# EAGLE design Xmas_A_board (EAGLE 9.6.2)
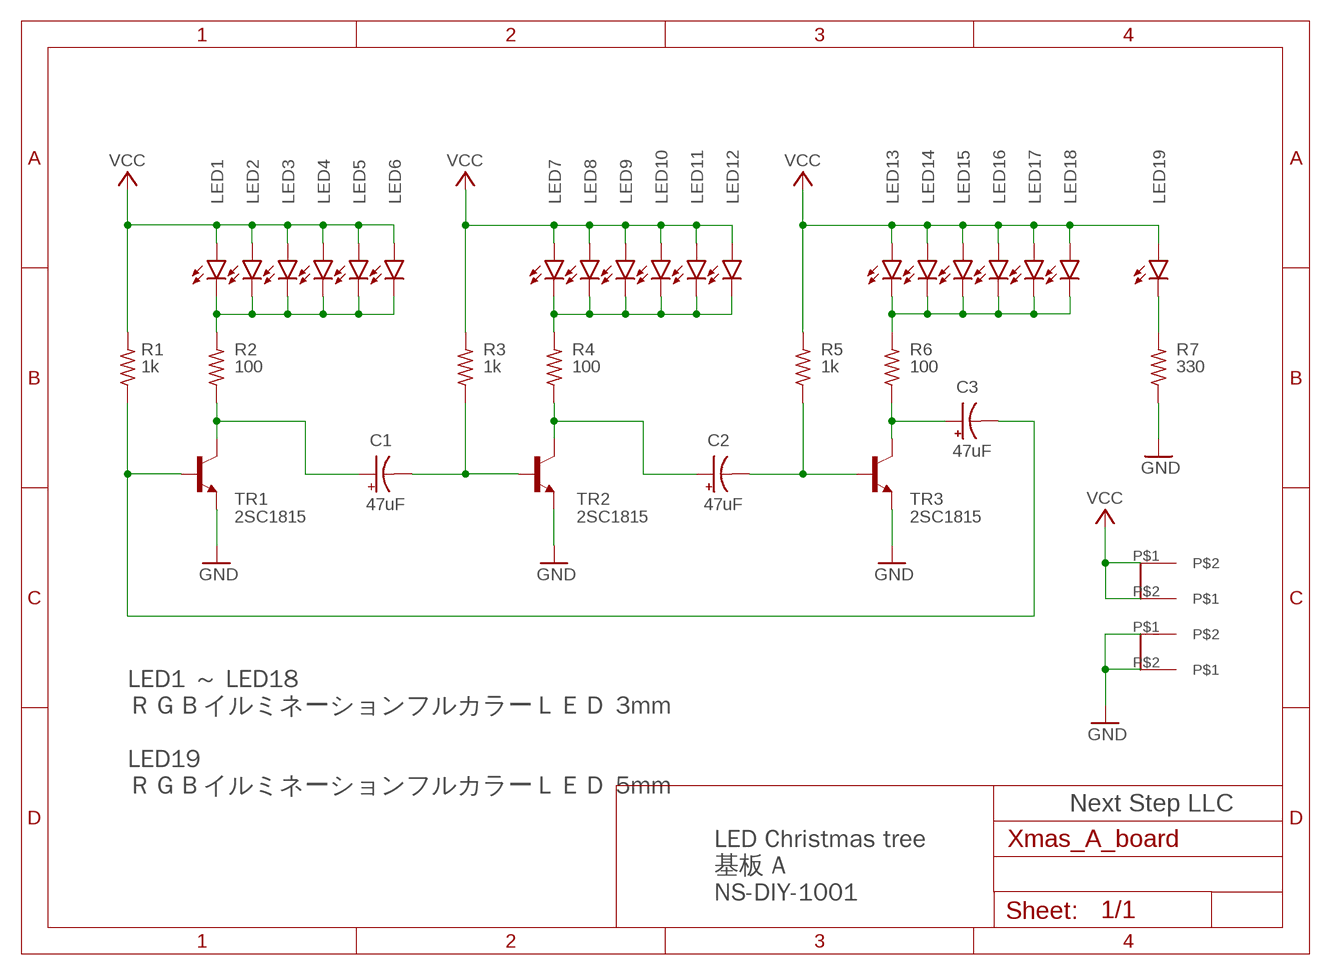
[diagram p0: schematic, sheet 1]

## Parts
C1  47uF  CPOL-USE2-4  [E2-4]
C2  47uF  CPOL-USE2-4  [E2-4]
C3  47uF  CPOL-USE2-4  [E2-4]
LED1  LED3MM  [LED3MM]
LED2  LED3MM  [LED3MM]
LED3  LED3MM  [LED3MM]
LED4  LED3MM  [LED3MM]
LED5  LED3MM  [LED3MM]
LED6  LED3MM  [LED3MM]
LED7  LED3MM  [LED3MM]
LED8  LED3MM  [LED3MM]
LED9  LED3MM  [LED3MM]
LED10  LED3MM  [LED3MM]
LED11  LED3MM  [LED3MM]
LED12  LED3MM  [LED3MM]
LED13  LED3MM  [LED3MM]
LED14  LED3MM  [LED3MM]
LED15  LED3MM  [LED3MM]
LED16  LED3MM  [LED3MM]
LED17  LED3MM  [LED3MM]
LED18  LED3MM  [LED3MM]
LED19  LED5MM  [LED5MM]
R1  1k  R-US_0204/7  [0204/7]
R2  100  R-US_0204/7  [0204/7]
R3  1k  R-US_0204/7  [0204/7]
R4  100  R-US_0204/7  [0204/7]
R5  1k  R-US_0204/7  [0204/7]
R6  100  R-US_0204/7  [0204/7]
R7  330  R-US_0204/7  [0204/7]
TR1  2SC1815  [TO92-ECB]
TR2  2SC1815  [TO92-ECB]
TR3  2SC1815  [TO92-ECB]
U$1  XMAS_POWER  [XMAS_POWER]
U$2  XMAS_POWER  [XMAS_POWER]

## Nets
GND: R7.1 TR1.E TR2.E TR3.E U$1.P$1 U$1.P$2
N$1: C3.- R1.1 TR1.B
N$2: LED1.K(C) LED2.K(C) LED3.K(C) LED4.K(C) LED5.K(C) LED6.K(C) R2.2
N$3: C1.+ R2.1 TR1.C
N$4: LED7.K(C) LED8.K(C) LED9.K(C) LED10.K(C) LED11.K(C) LED12.K(C) R4.2
N$5: C2.+ R4.1 TR2.C
N$6: C1.- R3.1 TR2.B
N$7: C3.+ R6.1 TR3.C
N$8: C2.- R5.1 TR3.B
N$10: LED13.K(C) LED14.K(C) LED15.K(C) LED16.K(C) LED17.K(C) LED18.K(C) R6.2
N$13: LED19.K(C) R7.2
VCC: LED1.A LED2.A LED3.A LED4.A LED5.A LED6.A LED7.A LED8.A LED9.A LED10.A LED11.A LED12.A LED13.A LED14.A LED15.A LED16.A LED17.A LED18.A LED19.A R1.2 R3.2 R5.2 U$2.P$1 U$2.P$2

## Notes on the sheet
- LED1 ～ LED18
  ＲＧＢイルミネーションフルカラーＬＥＤ 3mm
  
  LED19
  ＲＧＢイルミネーションフルカラーＬＥＤ 5mm
- Next Step LLC
- LED Christmas tree
  基板 A
  NS-DIY-1001

## Library data of the parts
C1-C3 = rcl:CPOL-US: POLARIZED CAPACITOR, American symbol; SPICEPREFIX: C
LED1-LED19 = led:LED: LED OSRAM: - CHIPLED LG R971, LG N971, LY N971, LG Q971, LY Q971, LO R971, LY R971 LH N974, LH R974 LS Q976, LO Q976, LY Q976 LO Q996 - Hyper CHIPLED LW Q18S LB Q993, LB Q99A, LB R99A - SideLED LS A670, LO A670, LY A670, LG A670, LP A670 LB A673, LV A673, LT A673, LW A673 LH A674 LY A675 LS A676, LA A676, LO A676, LY A676, LW A676 LS A679, LY A679, LG A679 - Hyper Micro SIDELED® LS Y876, LA Y876, LO Y876, LY Y876 LT Y87S - SmartLED LW L88C, LW L88S LB L89C, LB L89S, LG L890 LS L89K, LO L89K, LY L89K LS L896, LA L896, LO L896, LY L896 - TOPLED LS T670, LO T670, LY T670, LG T670, LP T670 LSG T670, LSP T670, LSY T670, LOP T670, LYG T670 LG T671, LOG T671, LSG T671 LB T673, LV T673, LT T673, LW T673 LH T674 LS T676, LA T676, LO T676, LY T676, LB T676, LH T676, LSB T676, LW T676 LB T67C, LV T67C, LT T67C, LS T67K, LO T67K, LY T67K, LW E67C LS E67B, LA E67B, LO E67B, LY E67B, LB E67C, LV E67C, LT E67C LW T67C LS T679, LY T679, LG T679 LS T770, LO T770, LY T770, LG T770, LP T770 LB T773, LV T773, LT T773, LW T773 LH T774 LS E675, LA E675, LY E675, LS T675 LS T776, LA T776, LO T776, LY T776, LB T776 LHGB T686 LT T68C, LB T68C - Hyper Mini TOPLED® LB M676 - Mini TOPLED Santana® LG M470 LS M47K, LO M47K, LY M47K Source: http://www.osram.convergy.de LUXEON: - LUMILED® LXK2-PW12-R00, LXK2-PW12-S00, LXK2-PW14-U00, LXK2-PW14-V00 LXK2-PM12-R00, LXK2-PM12-S00, LXK2-PM14-U00 LXK2-PE12-Q00, LXK2-PE12-R00, LXK2-PE12-S00, LXK2-PE14-T00, LXK2-PE14-U00 LXK2-PB12-K00, LXK2-PB12-L00, LXK2-PB12-M00, LXK2-PB14-N00, LXK2-PB14-P00, LXK2-PB14-Q00 LXK2-PR12-L00, LXK2-PR12-M00, LXK2-PR14-Q00, LXK2-PR14-R00 LXK2-PD12-Q00, LXK2-PD12-R00, LXK2-PD12-S00 LXK2-PH12-R00, LXK2-PH12-S00 LXK2-PL12-P00, LXK2-PL12-Q00, LXK2-PL12-R00 Source: www.luxeon.com KINGBRIGHT: KA-3528ASYC Source: www.kingbright.com
R1-R7 = rcl:R-US_: RESISTOR, American symbol; SPICEPREFIX: R
TR1-TR3 = transistor:2SC1815: NPN EPITAXIAL TRANSISTOR Source: TOSHIBA .. 2SC1815 1.pdf
U$1 U$2 = xmas_p:XMAS_POWER

## Board
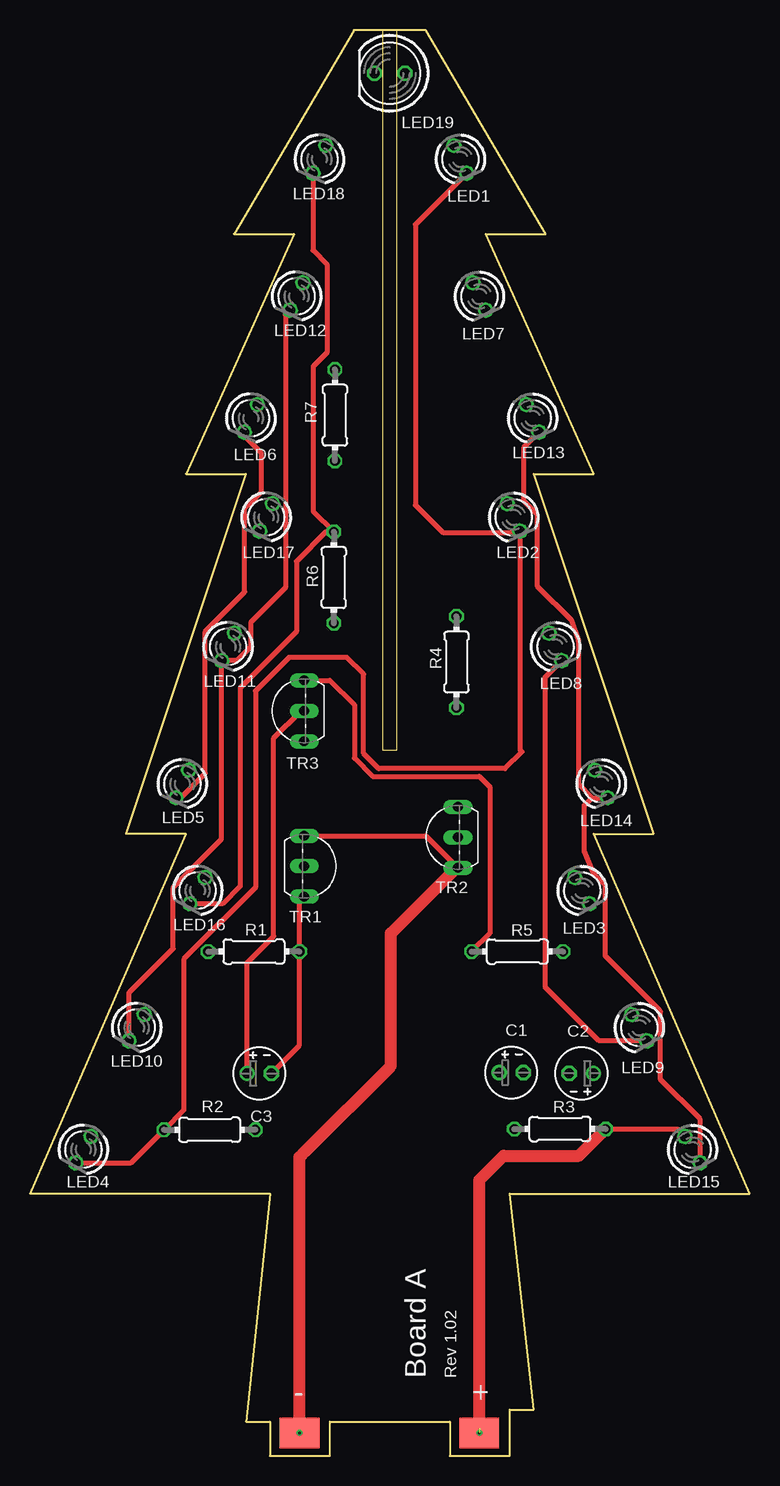
[diagram p1: board, top side]
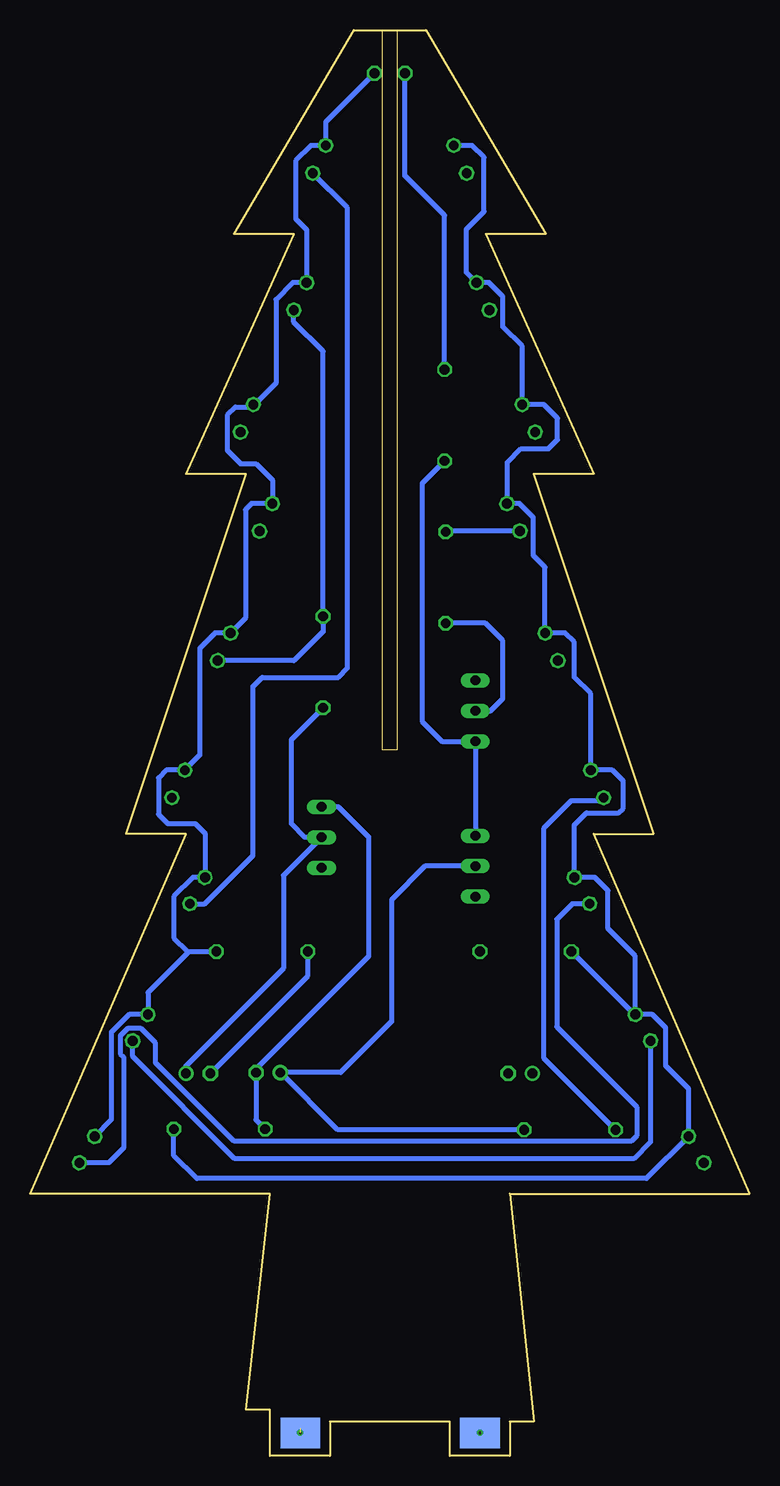
[diagram p2: board, bottom side, seen from below]

Size 60 x 118.86 mm. Coordinates in mm from the lower left corner, seen from the top.
Outline: 40,21.86 60,21.86 47,51.86 52,51.86 42,81.86 47,81.86 38,101.86 43,101.86 33,118.86 27,118.86 17,101.86 22,101.86 13,81.86 18,81.86 8,51.86 13,51.86 0,21.86 20,21.86 18,2.86 20,2.86 20,0 25,0 25,2.86 35,2.86 35,0 40,0 40,3.86 42,3.86 40,21.86
Copper layers (1*16): Top 0.035mm / dielectric 1.6mm / Bottom 0.035mm
Design rules "Elecrow_2-layer_PCB_eagle_rule": minimum track width 6mil, minimum drill 12mil, track to track 6mil, track to pad 6mil, pad to pad 6mil, via to via 8mil, smd to smd 0mil, copper to edge 20mil, drill to drill 10mil, minimum pad ring 6mil, minimum via ring 6mil, stop-mask expansion 0mil, vias tented up to drill 100mil, thermal gap 10mil
Milling: 6 lines

### Footprints (pad centres in the part's own frame; a part is rotated, then mirrored left to right if it is on the bottom)
E2-4 = drill 0.813 pad 1.27: + -1.016,0 | drill 0.813 pad 1.27 octagon: - 1.016,0
LED3MM = drill 0.813 octagon: A -1.27,0; K 1.27,0
LED5MM = drill 0.813 octagon: A -1.27,0; K 1.27,0
0204/7 = drill 0.813 octagon: 1 -3.81,0; 2 3.81,0
TO92-ECB = drill 0.813 long: B 2.54,0; C 0,0; E -2.54,0
XMAS_POWER = smd 3.302 x 2.54: P$1 0,0 | smd 3.302 x 2.54 bottom: P$2 0,0 | drill 0.2: P$3 0,0

### Placement (x,y rotation side)
C1  40.13,31.94 0 top
C2  45.97,31.88 180 top
C3  19.11,31.88 0 top
LED1  35.88,108.08 295 top
LED2  40.33,78.23 295 top
LED3  46.04,47.12 300 top
LED4  4.45,25.53 240 top
LED5  12.7,56.01 245 top
LED6  18.41,86.49 245 top
LED7  37.47,96.65 295 top
LED8  43.81,67.44 295 top
LED9  50.8,35.69 300 top
LED10  8.89,35.69 240 top
LED11  16.51,67.44 245 top
LED12  22.23,96.65 245 top
LED13  41.91,86.49 295 top
LED14  47.62,56.01 295 top
LED15  55.24,25.53 300 top
LED16  13.97,47.12 240 top
LED17  19.68,78.23 245 top
LED18  24.13,108.08 245 top
LED19  30,115.26 180 top
R1  18.67,42.04 180 top
R2  14.99,27.18 180 top
R3  44.2,27.24 0 top
R4  35.56,66.17 90 top
R5  40.64,42.04 0 top
R6  25.34,73.22 90 top
R7  25.43,86.74 90 top
TR1  22.86,49.15 270 top
TR2  35.69,51.56 90 top
TR3  22.86,62.1 90 top
U$1  22.48,1.91 0 top
U$2  37.47,1.91 0 top

### Tracks (layer width: path | path; a pad name or v marks a point on that pad's centre or on a via)
GND  (1 unrouted)
  Top 0.406: TR1.E 33.02,51.69 TR2.E
  Top 1.016: TR2.E 35.56,49.02 30.1,43.56 30.1,32.51 22.99,25.4 22.48,24.89 U$1.P$1
  Bottom 0.406: TR1.E TR3.E 25.65,59.56 27.3,61.21 27.3,81.06 R7.1
N$1
  Top 0.406: TR1.B 22.48,46.23 R1.1 22.48,34.23 C3.-
N$2
  Top 0.406: LED1.K 32.13,102.64 32.13,79.25 34.42,76.96 40.74,76.96 LED2.K 40.86,58.83 41.02,58.67 39.62,57.28 29.08,57.28 27.81,58.55 27.81,65.15 26.42,66.55 21.59,66.55 18.8,63.75 18.8,47.37 12.83,41.4 12.83,28.83 R2.2 8.43,24.43 LED4.K | LED5.K 12.56,54.86 14.61,56.9 14.61,68.71 17.91,72.01 17.91,78.99 19.3,80.39 19.3,83.57 17.88,84.99 LED6.K
  Bottom 0.406: LED3.K 45.42,46.02 41.4,50.04 41.4,64.14 40.64,64.9 34.29,64.9 33.53,65.66 33.53,104.04 LED1.K | R2.2 17.14,33.15 17.14,52.32 14.86,54.61 12.41,54.61 LED5.K
N$3
  Bottom 0.406: R2.1 34.35,27.18 C1.+ 34.1,31.94 29.84,36.2 29.84,46.35 27.05,49.15 TR1.C
N$4
  Top 0.406: LED9.K 47.45,34.59 42.95,39.09 42.95,64.89 LED8.K | LED10.K 8.26,38.61 11.94,42.29 11.94,47.37 15.97,51.41 LED11.K 17.26,66.29 18.41,67.44 18.41,69.47 21.31,72.36 21.31,95.11 LED12.K
  Bottom 0.406: LED7.K 38,94.52 35.56,92.08 R4.2 35.56,68.71 37.98,66.29 LED8.K | LED10.K 8.26,26.16 9.65,24.77 42.93,24.77 51.44,33.27 LED9.K
N$5
  Bottom 0.406: R4.1 38.23,59.69 38.23,52.7 37.08,51.56 TR2.C 38.86,48.39 38.86,40.64 46.99,32.51 C2.+
N$6
  Bottom 0.406: R3.1 41.15,28 C1.- 41.15,32.26 31.75,41.66 31.75,51.56 34.29,54.1 TR2.B
N$7
  Top 0.406: C3.+ 18.1,41.08 20.32,43.31 20.32,59.82 22.61,62.1 TR3.C
  Bottom 0.406: TR3.C 21.59,62.1 20.57,63.12 20.57,67.94 22.04,69.41 R6.1
N$8
  Top 0.406: TR3.B 25.02,64.64 27.05,62.61 27.05,58.17 28.57,56.64 37.47,56.64 38.35,55.75 38.35,43.56 R5.1
  Bottom 0.406: C2.- 36.83,40.01 R5.1
N$10
  Top 0.406: LED13.K 41.15,84.04 41.15,79.63 42.29,78.49 42.29,72.52 45.15,69.66 45.72,67.95 45.72,56.01 46.87,54.86 | 46.87,54.86 LED14.K | LED15.K 55.88,28.07 52.58,31.37 52.58,37 52.52,37.14 47.98,41.69 47.98,47.53 47.08,48.42 46.21,50.42 46.21,52.18 46.23,52.2 46.23,54.21 46.87,54.86 | LED18.K 23.59,100.49 24.77,99.31 24.77,91.95 23.62,90.8 23.62,78.74 R6.2 24.7,77.03 22.23,74.55 22.23,68.71 17.53,64.01 17.53,47.5 16.05,46.02 LED16.K
  Bottom 0.406: LED17.K 25.28,77.08 R6.2 | LED16.K 14.78,46.02 16.08,44.72 16.08,35.76 9.4,29.08 9.4,26.67 9.86,26.21 42.98,26.21 49.53,32.77 49.53,34.42 50.74,35.62 51.86,35.62 52.47,35.02 52.47,33.52 52.2,33.25 52.2,25.65 53.42,24.43 LED15.K
N$13
  Bottom 0.406: R7.2 25.43,103.41 28.73,106.71 LED19.K
VCC  (2 unrouted)
  Top 0.406: R3.2 53.99,27.24 LED15.A
  Top 1.016: 37.47,2.29 37.47,22.99 39.5,25.02 45.78,25.02 R3.2
  Bottom 0.406: LED19.A 35.34,111.18 LED1.A 36.57,109.23 37.85,107.95 37.85,103.12 36.93,102.21 LED7.A 38.09,97.8 39.5,96.39 39.5,89.41 41.27,87.64 | 46.74,42.04 46.86,42.04 48.01,43.18 48.01,46.61 46.4,48.22 LED3.A 45.41,51.88 46.23,52.7 48.51,52.7 49.28,53.47 49.28,56.52 48.63,57.16 LED14.A 45.85,58.4 45.85,67.31 44.57,68.59 LED8.A 42.04,69.83 42.04,78.87 41.52,79.38 LED2.A 39.79,81.35 41.15,82.71 42.45,82.71 43.56,83.82 43.56,86.74 42.86,87.44 41.47,87.44 41.27,87.64 | 46.74,42.04 R5.2 | LED15.A 53.21,28.02 53.21,35.31 51.73,36.79 LED9.A 50.16,38.61 46.74,42.04 | LED10.A 8.09,36.79 6.99,35.69 6.99,32.51 5.08,30.61 LED4.A 8.59,23.11 46.1,23.11 48.01,25.02 R3.2 | LED10.A 9.61,36.79 R1.2 | LED10.A 9.53,41.66 11.81,43.94 11.81,47.12 12.91,48.22 LED16.A 14.61,52.58 13.59,53.59 10.92,53.59 10.54,53.98 10.54,56.26 11.44,57.16 LED5.A 13.24,63.53 14.61,64.9 14.61,67.82 15.38,68.59 LED11.A 17.05,74.07 18.03,75.06 18.03,78.23 19.18,79.38 LED17.A 20.19,79.41 20.19,82.8 19.05,83.95 16.76,83.95 16,84.71 16,86.49 17.15,87.64 LED6.A 18.95,92.48 20.57,94.11 20.57,96.65 21.73,97.8 LED12.A 23.62,98.66 23.62,102.23 22.14,103.72 22.14,108.23 23.13,109.23 LED18.A | 41.27,87.64 LED13.A

### Text on the board
tPlace: Board A | Rev 1.02 | - | +